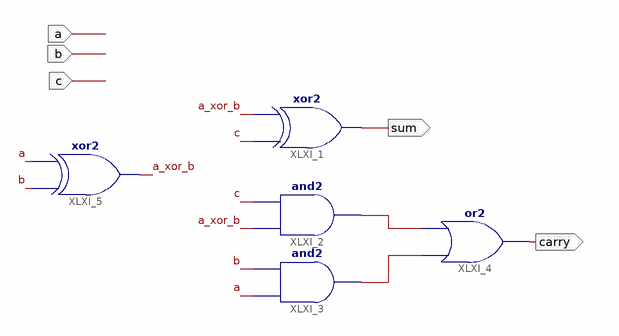
[diagram p0: schematic sheet 1]
// Xilinx ISE schematic fulladd_sc.sch (spartan6) as structural Verilog: 5 symbols, 5 ports
module fulladd_sc (
  input  c,
  input  b,
  input  a,
  output sum,
  output carry
);

  wire a_xor_b, XLXN_19, XLXN_20;

  xor XLXI_1 (sum, c, a_xor_b);
  and XLXI_2 (XLXN_19, a_xor_b, c);
  and XLXI_3 (XLXN_20, a, b);
  or XLXI_4 (carry, XLXN_20, XLXN_19);
  xor XLXI_5 (a_xor_b, b, a);
endmodule
